# Altium schematic sheet Input.SchDoc
size A4
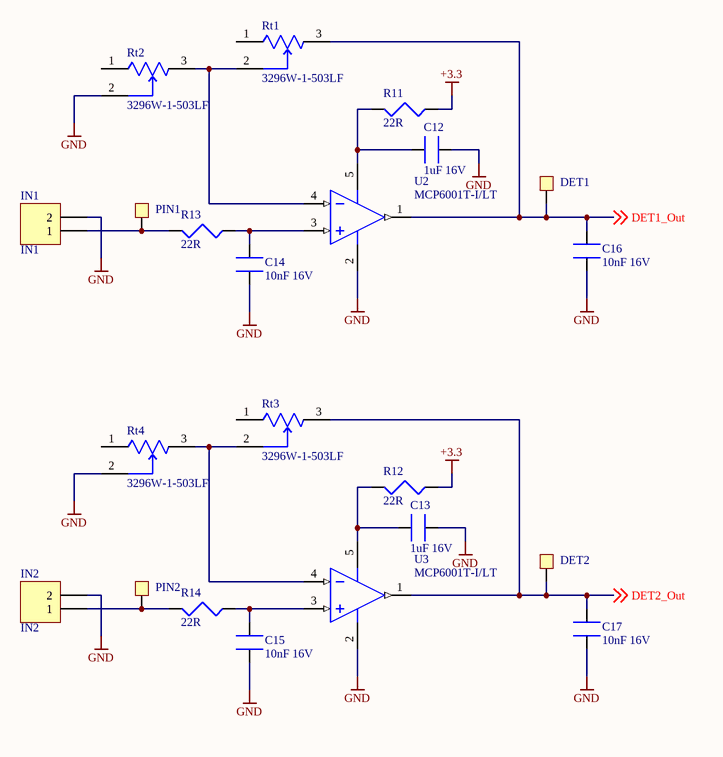
[diagram p0: Input.SchDoc]

## Parts
C12  1uF 16V  [0805_C]
C13  1uF 16V  [0805_C]
C14  10nF 16V  [0805_C]
C15  10nF 16V  [0805_C]
C16  10nF 16V  [0805_C]
C17  10nF 16V  [0805_C]
DET1  Point  [Test_Point]  (value not drawn)
DET2  Point  [Test_Point]  (value not drawn)
IN1  IN1  [HDR1X2]
IN2  IN2  [HDR1X2]
PIN1  Point  [Test_Point]  (value not drawn)
PIN2  Point  [Test_Point]  (value not drawn)
R11  22R  [0805_R]
R12  22R  [0805_R]
R13  22R  [0805_R]
R14  22R  [0805_R]
Rt1  3296W-1-503LF  [FP-3296W-MFG]
Rt2  3296W-1-503LF  [FP-3296W-MFG]
Rt3  3296W-1-503LF  [FP-3296W-MFG]
Rt4  3296W-1-503LF  [FP-3296W-MFG]
U2  MCP6001T-I/LT  [SC70-LT5_M]
U3  MCP6001T-I/LT  [SC70-LT5_M]

## Nets
+3.3: R11.2 R12.2
GND: C12.2 C13.2 C14.2 C15.2 C16.2 C17.2 IN1.2 IN2.2 Rt2.2(WIPER) Rt4.2(WIPER) U2.2(VSS) U3.2(VSS)
DET1_Out: C16.1 DET1.1 Rt1.3(CW) U2.1(VOUT) ; off-sheet DET1_Out
DET2_Out: C17.1 DET2.1 Rt3.3(CW) U3.1(VOUT) ; off-sheet DET2_Out
NetC12_1: C12.1 R11.1 U2.5(VDD)
NetC13_1: C13.1 R12.1 U3.5(VDD)
NetC14_1: C14.1 R13.2 U2.3(VIN+)
NetC15_1: C15.1 R14.2 U3.3(VIN+)
NetIN1_1: IN1.1 PIN1.1 R13.1
NetIN2_1: IN2.1 PIN2.1 R14.1
NetRt1_2: Rt1.2(WIPER) Rt2.3(CW) U2.4(VIN-)
NetRt3_2: Rt3.2(WIPER) Rt4.3(CW) U3.4(VIN-)

Not connected (* = marked no-connect by the designer): Rt1 1(CCW); Rt2 1(CCW); Rt3 1(CCW); Rt4 1(CCW)

## Library data of the parts
C12-C17 = Cap
IN1 IN2 = Header 2: Header, 2-Pin; LatestRevisionDate: 17-Jul-2002; LatestRevisionNote: Re-released for DXP Platform.; Publisher: Altium Limited
R11-R14 = Res
Rt1-Rt4 = CMP-2000-05583-2: TRIMMER 50K OHM 0.5W PC PIN TOP; Manufacturer: Bourns; Manufacturer Part Number: 3296W-1-504LF; Resistance: 500kΩ; Temperature Coefficient: 100ppm/°C; Value: 500kΩ; Tolerance: 10%; Voltage Rating: 300V; Standoff Height: 0.38mm; ComponentLink2Description: Datasheet; Package: 3296W; Series: Trimpot 3296-Sealed; Lead Free: Yes; Octopart: https://octopart.com/3296w-1-504lf-bourns-143884; Device Class L2: Resistors; Automotive: No; RoHS: TRUE; Temperature Range High: +125°C; Height: 12.05mm; Power Rating: 0.5W; Temperature Range Low: -55°C; ComponentLink2URL: https://www.bourns.com/docs/Product-Datasheets/3296.pdf; Device Class L1: Passive Components; Device Class L3: Variable Resistors and Potentiometers; Category: Res; Temperature: -55°C to +125°C; Digikey Description: TRIMMER 500K OHM 0.5W PC PIN TOP; Mouser Description: Trimmer; Cermet; Rest 500 Kilohms; PCB; 25 Turns; Pwr-Rtg 0.5W
U2 U3 = CMP-0187-00457-2: 1 MHz, Low-Power Operational Amplifier, 5-Pin SC-70, Industrial Temperature, Tape and Reel; RevisionNote: URLs added.; ComponentLink2Description: Datasheet; ComponentLink3URL: http://www.microchip.com/stellent/groups/techpub_sg/documents/packagingspec/en012702.pdf; PackageReference: SC70-LT5; PackageDescription: 5-Lead Plastic Small Outline Transistor (LT) [SC70]; ComponentLink2URL: http://ww1.microchip.com/downloads/en/DeviceDoc/21733j.pdf; ComponentLink3Description: Package Specification; PackageVersion: revBB, Aug-2009; ComponentLink1Description: Manufacturer URL; DatasheetVersion: revJ, Nov-2009; ComponentLink1URL: http://www.microchip.com/; Code_IPC: SOT353-5